# EAGLE design Pulsar Buddy SM (EAGLE 9.6.1)

## Sheet 1 of 2
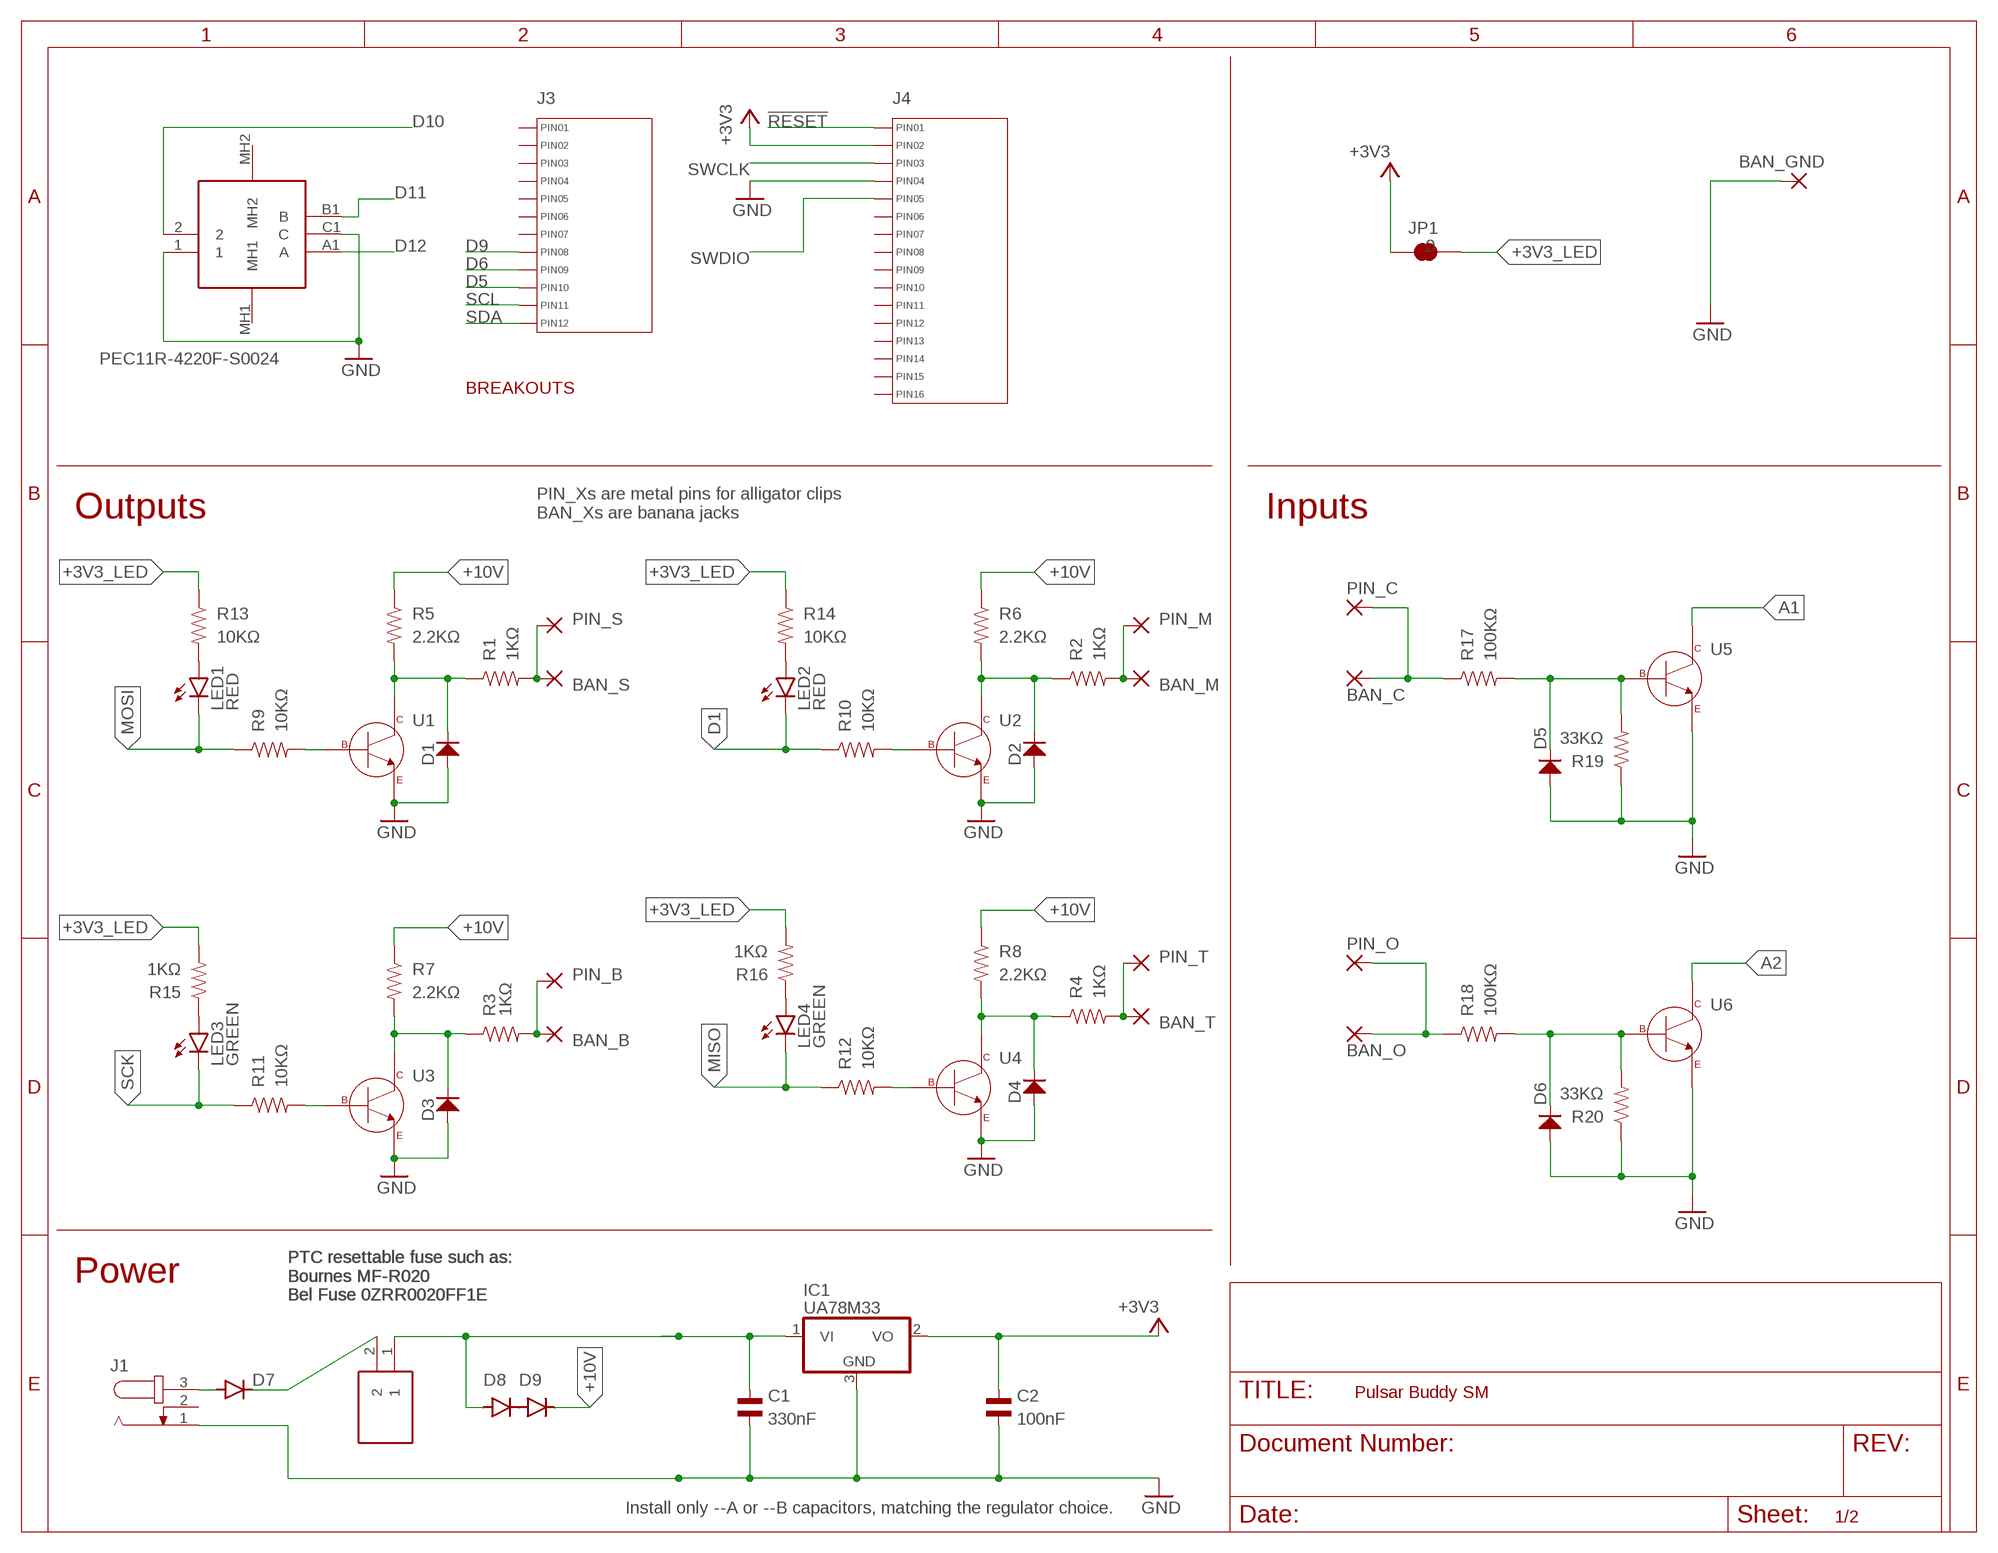
[diagram p0: schematic, sheet 1]

### Parts
BAN_B  WIREPADBANANA  [BANANA]
BAN_C  WIREPADBANANA  [BANANA]
BAN_GND  WIREPADBANANA-GND  [BANANA-GND]
BAN_M  WIREPADBANANA  [BANANA]
BAN_O  WIREPADBANANA  [BANANA]
BAN_S  WIREPADBANANA  [BANANA]
BAN_T  WIREPADBANANA  [BANANA]
C1  330nF  CAPACITOR_NP_0603  [C0603]
C2  100nF  CAPACITOR_NP_0603  [C0603]
D1  MF-DIO-SOD123-BAT42  DIODES_BAT42_SOD-123  [SOD-123]
D2  MF-DIO-SOD123-BAT42  DIODES_BAT42_SOD-123  [SOD-123]
D3  MF-DIO-SOD123-BAT42  DIODES_BAT42_SOD-123  [SOD-123]
D4  MF-DIO-SOD123-BAT42  DIODES_BAT42_SOD-123  [SOD-123]
D5  MF-DIO-SOD123-BAT42  DIODES_BAT42_SOD-123  [SOD-123]
D6  MF-DIO-SOD123-BAT42  DIODES_BAT42_SOD-123  [SOD-123]
D7  CGRM4004-G  [SOD-123_MINI-SMA]
D8  CGRM4004-G  [SOD-123_MINI-SMA]
D9  CGRM4004-G  [SOD-123_MINI-SMA]
F1  0ZCJ0020FF2E  [FUSC3216X75N]
IC1  UA78M33  7805DT  [TO252]
J1  JACK-PLUG0  [SPC4077]
J3  MF-CON-2.54mm-01x12  CON_01X12_PTH_2.54MM  [PTH_2.54MM_01X12]
J4  MF-CON-2.54mm-01x16  CON_01X16_PTH_2.54MM  [PTH_2.54MM_01X16]
JP1  JUMPER-SMT_2_NC_TRACE_SILK  [SMT-JUMPER_2_NC_TRACE_SILK]
LED1  RED  LED5MM  [LED5MM]
LED2  RED  LED5MM  [LED5MM]
LED3  GREEN  LED5MM  [LED5MM]
LED4  GREEN  LED5MM  [LED5MM]
PIN_B  WIREPAD  [M3]
PIN_C  WIREPAD  [M3]
PIN_M  WIREPAD  [M3]
PIN_O  WIREPAD  [M3]
PIN_S  WIREPAD  [M3]
PIN_T  WIREPAD  [M3]
R1  1KΩ  RESISTOR_0603  [R0603]
R2  1KΩ  RESISTOR_0603  [R0603]
R3  1KΩ  RESISTOR_0603  [R0603]
R4  1KΩ  RESISTOR_0603  [R0603]
R5  2.2KΩ  RESISTOR_0603  [R0603]
R6  2.2KΩ  RESISTOR_0603  [R0603]
R7  2.2KΩ  RESISTOR_0603  [R0603]
R8  2.2KΩ  RESISTOR_0603  [R0603]
R9  10KΩ  RESISTOR_0603  [R0603]
R10  10KΩ  RESISTOR_0603  [R0603]
R11  10KΩ  RESISTOR_0603  [R0603]
R12  10KΩ  RESISTOR_0603  [R0603]
R13  10KΩ  RESISTOR_0603  [R0603]
R14  10KΩ  RESISTOR_0603  [R0603]
R15  1KΩ  RESISTOR_0603  [R0603]
R16  1KΩ  RESISTOR_0603  [R0603]
R17  100KΩ  RESISTOR_0603  [R0603]
R18  100KΩ  RESISTOR_0603  [R0603]
R19  33KΩ  RESISTOR_0603  [R0603]
R20  33KΩ  RESISTOR_0603  [R0603]
SW1  PEC11R-4220F-S0024  [PEC11R4220FS0024]
U1  MF-DSC-SOT233-MMBT3904  NPN_BJTMMBT3904_SOT-23-3  [SOT-23-3]
U2  MF-DSC-SOT233-MMBT3904  NPN_BJTMMBT3904_SOT-23-3  [SOT-23-3]
U3  MF-DSC-SOT233-MMBT3904  NPN_BJTMMBT3904_SOT-23-3  [SOT-23-3]
U4  MF-DSC-SOT233-MMBT3904  NPN_BJTMMBT3904_SOT-23-3  [SOT-23-3]
U5  MF-DSC-SOT233-MMBT3904  NPN_BJTMMBT3904_SOT-23-3  [SOT-23-3]
U6  MF-DSC-SOT233-MMBT3904  NPN_BJTMMBT3904_SOT-23-3  [SOT-23-3]

### Nets
!RESET: J4.P$1(PIN1) ; also sheet 2
+3V3: C2.P$1 IC1.2(VO) J4.P$2(PIN2) JP1.1 ; also sheet 2
+3V3_LED: JP1.2 R13.P$1 R14.P$1 R15.P$2 R16.P$2
+10V: D9.C R5.P$1 R6.P$1 R7.P$1 R8.P$1
+12V: C1.P$1 D8.A F1.1 IC1.1(VI)
A1: U5.P$3(COLLECTOR) ; also sheet 2
A2: U6.P$3(COLLECTOR) ; also sheet 2
D1: LED2.K(C) R10.P$1 ; also sheet 2
D5: J3.P$10(PIN10) ; also sheet 2
D6: J3.P$9(PIN9) ; also sheet 2
D9: J3.P$8(PIN8) ; also sheet 2
D10: SW1.2 ; also sheet 2
D11: SW1.B1(B) ; also sheet 2
D12: SW1.A1(A) ; also sheet 2
GND: BAN_GND.C(P) C1.P$2 C2.P$2 D1.ANODE D2.ANODE D3.ANODE D4.ANODE D5.ANODE D6.ANODE IC1.3(GND) J1.1 J4.P$4(PIN4) R19.P$1 R20.P$1 SW1.1 SW1.C1(C) U1.P$2(EMITTER) U2.P$2(EMITTER) U3.P$2(EMITTER) U4.P$2(EMITTER) U5.P$2(EMITTER) U6.P$2(EMITTER) ; also sheet 2
MISO: LED4.K(C) R12.P$1 ; also sheet 2
MOSI: LED1.K(C) R9.P$1 ; also sheet 2
N$1: R10.P$2 U2.P$1(BASE)
N$4: D7.C F1.2
N$5: D7.A J1.3
N$6: LED1.A R13.P$2
N$7: LED2.A R14.P$2
N$8: R9.P$2 U1.P$1(BASE)
N$9: D1.CATHODE R1.P$1 R5.P$2 U1.P$3(COLLECTOR)
N$11: D2.CATHODE R2.P$1 R6.P$2 U2.P$3(COLLECTOR)
N$12: LED3.A R15.P$1
N$13: R11.P$2 U3.P$1(BASE)
N$14: D3.CATHODE R3.P$1 R7.P$2 U3.P$3(COLLECTOR)
N$15: LED4.A R16.P$1
N$16: R12.P$2 U4.P$1(BASE)
N$17: D4.CATHODE R4.P$1 R8.P$2 U4.P$3(COLLECTOR)
N$18: D5.CATHODE R17.P$2 R19.P$2 U5.P$1(BASE)
N$19: BAN_O.C(P) PIN_O.1(P) R18.P$1
N$20: BAN_C.C(P) PIN_C.1(P) R17.P$1
N$21: D6.CATHODE R18.P$2 R20.P$2 U6.P$1(BASE)
N$36: D8.C D9.A
N$37: BAN_S.C(P) PIN_S.1(P) R1.P$2
N$38: BAN_M.C(P) PIN_M.1(P) R2.P$2
N$39: BAN_T.C(P) PIN_T.1(P) R4.P$2
N$40: BAN_B.C(P) PIN_B.1(P) R3.P$2
SCK: LED3.K(C) R11.P$1 ; also sheet 2
SCL: J3.P$11(PIN11) ; also sheet 2
SDA: J3.P$12(PIN12) ; also sheet 2
SWCLK: J4.P$3(PIN3) ; also sheet 2
SWDIO: J4.P$5(PIN5) ; also sheet 2
Unconnected: J1.2 J3.P$1(PIN1) J3.P$2(PIN2) J3.P$3(PIN3) J3.P$4(PIN4) J3.P$5(PIN5) J3.P$6(PIN6) J3.P$7(PIN7) J4.P$6(PIN6) J4.P$7(PIN7) J4.P$8(PIN8) J4.P$9(PIN9) J4.P$10(PIN10) J4.P$11(PIN11) J4.P$12(PIN12) J4.P$13(PIN13) J4.P$14(PIN14) J4.P$15(PIN15) J4.P$16(PIN16) SW1.MH1 SW1.MH2

### Notes on the sheet
- BREAKOUTS
- Outputs
- PIN_Xs are metal pins for alligator clips
  BAN_Xs are banana jacks
- Inputs
- Power
- PTC resettable fuse such as:
  Bournes MF-R020
  Bel Fuse 0ZRR0020FF1E
- PTC resettable fuse such as:
  Bournes MF-R020
  Bel Fuse 0ZRR0020FF1E
- PTC resettable fuse such as:
  Bournes MF-R020
  Bel Fuse 0ZRR0020FF1E
- Install only --A or --B capacitors, matching the regulator choice.

## Sheet 2 of 2
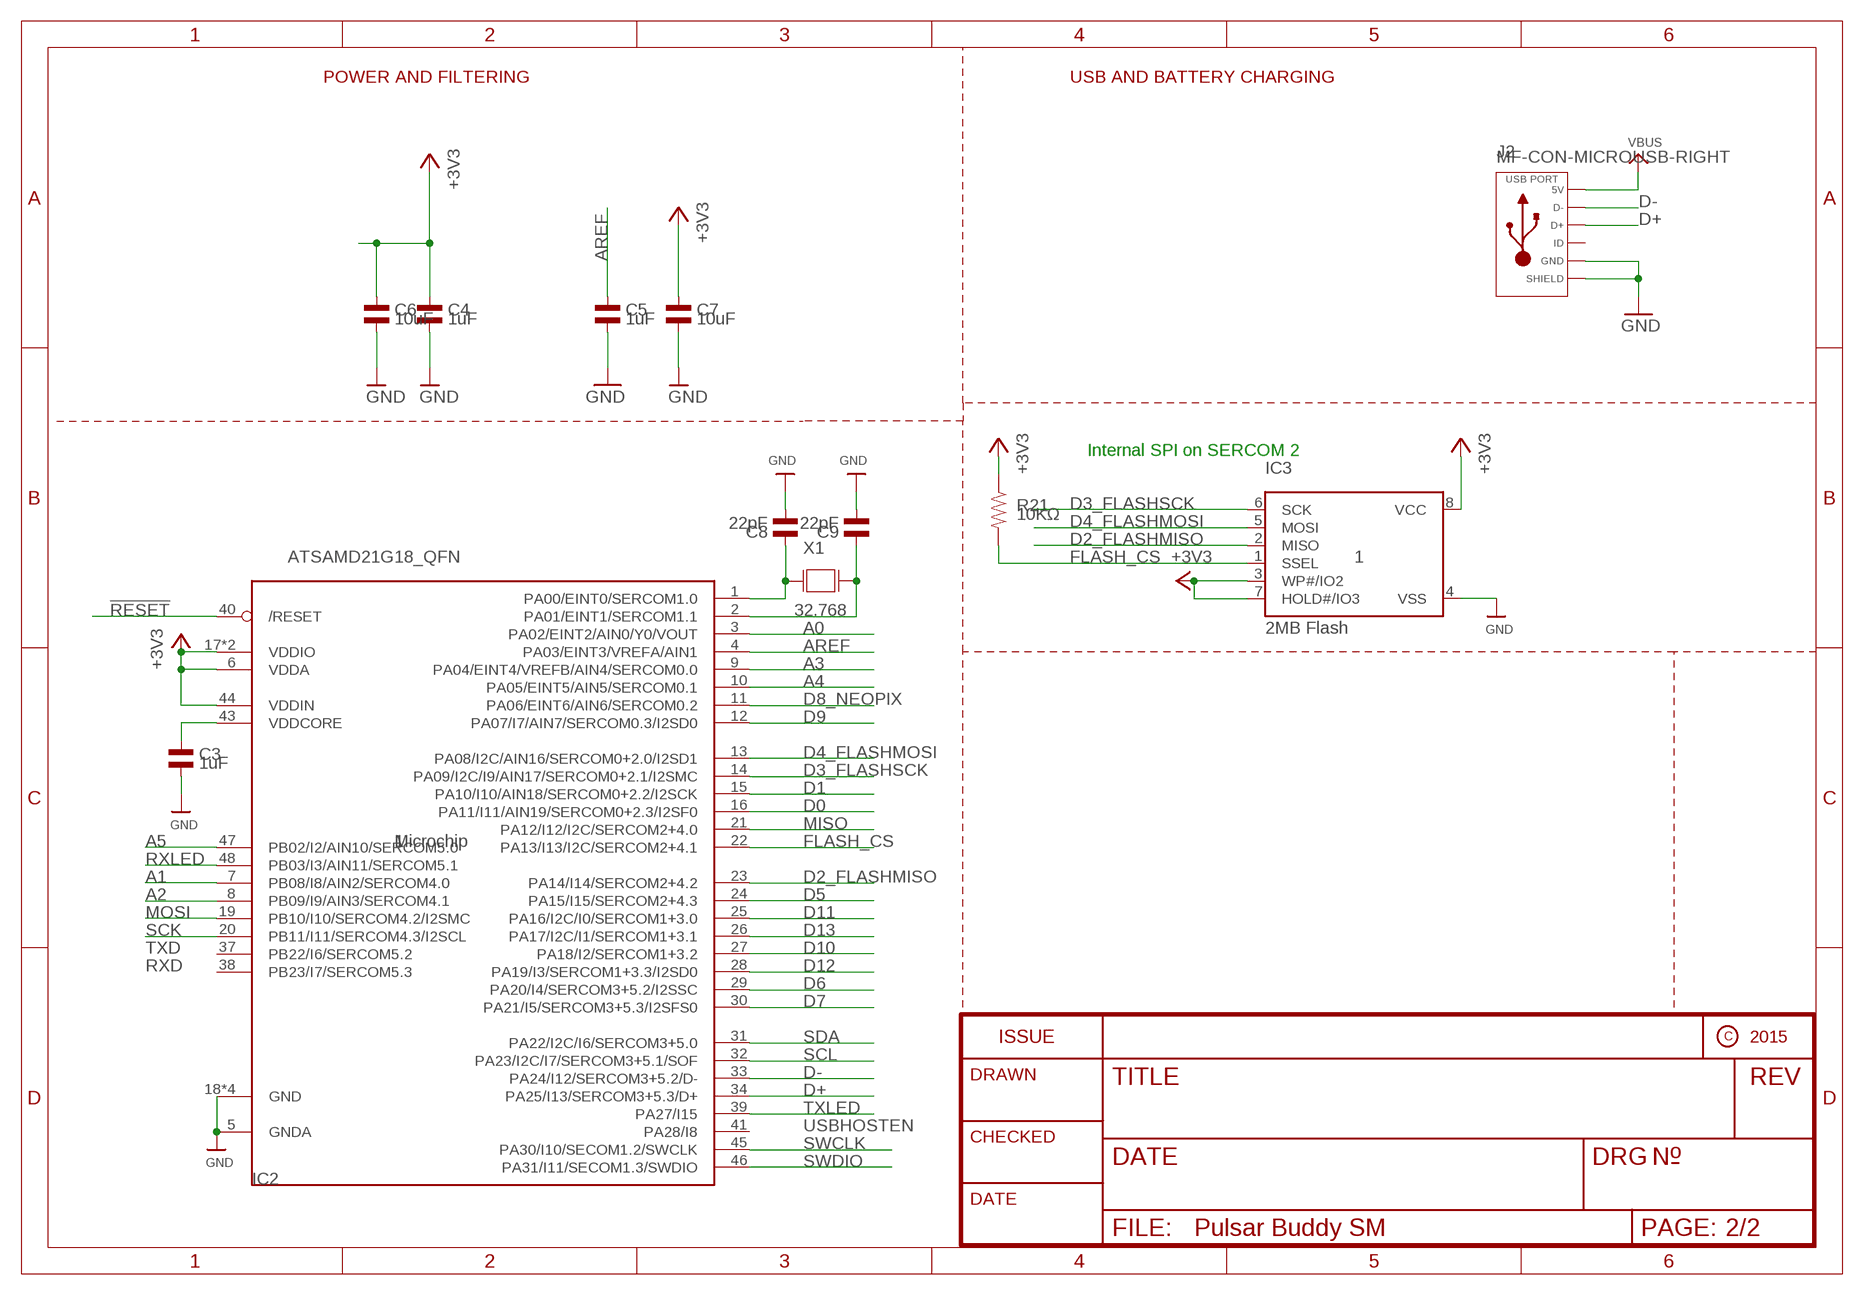
[diagram p1: schematic, sheet 2]

### Parts
C3  1uF  CAPACITOR_NP_0603  [C0603]
C4  1uF  CAPACITOR_NP_0603  [C0603]
C5  1uF  CAPACITOR_NP_0603  [C0603]
C6  10uF  CAPACITOR_NP_0603  [C0603]
C7  10uF  CAPACITOR_NP_0603  [C0603]
C8  22pF  CAPACITOR_NP_0603  [C0603]
C9  22pF  CAPACITOR_NP_0603  [C0603]
IC2  ATSAMD21G18_QFN  ATSAMD21G_QFN  [TQFN48_7MM]
IC3  2MB Flash  SPIFLASH_SOIC8208MIL  [SOIC8_208MIL]
J2  MF-CON-MICROUSB-RIGHT  USB_MICRO_RIGHT  [MICROUSB-RIGHT]
R21  10KΩ  RESISTOR_0603  [R0603]
U$34  FIDUCIAL_100MIL  [FIDUCIAL_100MIL]
U$35  FIDUCIAL_100MIL  [FIDUCIAL_100MIL]
X1  32.768  CYRSTAL_ECX-31B  [ECX-31B_SERIES]

### Nets
!RESET: IC2.40(/RESET) ; also sheet 1
+3V3: C4.P$1 C6.P$1 C7.P$1 IC2.6(VDDA) IC2.17(VDDIO) IC2.36(VDDIO) IC2.44(VDDIN) IC3.3(WP#/IO2) IC3.7(HOLD#/IO3) IC3.8(VCC) R21.P$1 ; also sheet 1
A0: IC2.3(PA02/EINT2/AIN0/Y0/VOUT)
A1: IC2.7(PB08/I8/AIN2/SERCOM4.0) ; also sheet 1
A2: IC2.8(PB09/I9/AIN3/SERCOM4.1) ; also sheet 1
A3: IC2.9(PA04/EINT4/VREFB/AIN4/SERCOM0.0)
A4: IC2.10(PA05/EINT5/AIN5/SERCOM0.1)
A5: IC2.47(PB02/I2/AIN10/SERCOM5.0)
AREF: C5.P$1 IC2.4(PA03/EINT3/VREFA/AIN1)
D0: IC2.16(PA11/I11/AIN19/SERCOM0+2.3/I2SF0)
D1: IC2.15(PA10/I10/AIN18/SERCOM0+2.2/I2SCK) ; also sheet 1
D2_FLASHMISO: IC2.23(PA14/I14/SERCOM2+4.2) IC3.2(MISO)
D3_FLASHSCK: IC2.14(PA09/I2C/I9/AIN17/SERCOM0+2.1/I2SMC) IC3.6(SCK)
D4_FLASHMOSI: IC2.13(PA08/I2C/AIN16/SERCOM0+2.0/I2SD1) IC3.5(MOSI)
D5: IC2.24(PA15/I15/SERCOM2+4.3) ; also sheet 1
D6: IC2.29(PA20/I4/SERCOM3+5.2/I2SSC) ; also sheet 1
D7: IC2.30(PA21/I5/SERCOM3+5.3/I2SFS0)
D8_NEOPIX: IC2.11(PA06/EINT6/AIN6/SERCOM0.2)
D9: IC2.12(PA07/I7/AIN7/SERCOM0.3/I2SD0) ; also sheet 1
D10: IC2.27(PA18/I2/SERCOM1+3.2) ; also sheet 1
D11: IC2.25(PA16/I2C/I0/SERCOM1+3.0) ; also sheet 1
D12: IC2.28(PA19/I3/SERCOM1+3.3/I2SD0) ; also sheet 1
D13: IC2.26(PA17/I2C/I1/SERCOM1+3.1)
D+: IC2.34(PA25/I13/SERCOM3+5.3/D+) J2.3(D+)
D-: IC2.33(PA24/I12/SERCOM3+5.2/D-) J2.2(D-)
FLASH_CS: IC2.22(PA13/I13/I2C/SERCOM2+4.1) IC3.1(SSEL) R21.P$2
GND: C3.P$2 C4.P$2 C5.P$2 C6.P$2 C7.P$2 C8.P$2 C9.P$2 IC2.5(GNDA) IC2.18(GND) IC2.35(GND) IC2.42(GND) IC2.THERMAL(GND) IC3.4(VSS) J2.5(GND) J2.S1(SLD) J2.S2(SLD) J2.S3(SLD) J2.S4(SLD) J2.S5(SLD) J2.S6(SLD) ; also sheet 1
MISO: IC2.21(PA12/I12/I2C/SERCOM2+4.0) ; also sheet 1
MOSI: IC2.19(PB10/I10/SERCOM4.2/I2SMC) ; also sheet 1
N$45: C8.P$1 IC2.1(PA00/EINT0/SERCOM1.0) X1.P$1(X0)
N$46: C9.P$1 IC2.2(PA01/EINT1/SERCOM1.1) X1.P$2(X1)
RXLED: IC2.48(PB03/I3/AIN11/SERCOM5.1)
SCK: IC2.20(PB11/I11/SERCOM4.3/I2SCL) ; also sheet 1
SCL: IC2.32(PA23/I2C/I7/SERCOM3+5.1/SOF) ; also sheet 1
SDA: IC2.31(PA22/I2C/I6/SERCOM3+5.0) ; also sheet 1
SWCLK: IC2.45(PA30/I10/SECOM1.2/SWCLK) ; also sheet 1
SWDIO: IC2.46(PA31/I11/SECOM1.3/SWDIO) ; also sheet 1
TXLED: IC2.39(PA27/I15)
VBUS: J2.1(5V)
VDDCORE1: C3.P$1 IC2.43(VDDCORE)
Unconnected: IC2.37(PB22/I6/SERCOM5.2) IC2.38(PB23/I7/SERCOM5.3) IC2.41(PA28/I8) J2.4(ID)

### Notes on the sheet
- POWER AND FILTERING | USB AND BATTERY CHARGING
- Internal SPI on SERCOM 2
- TXD
- RXD
- USBHOSTEN

## Library data of the parts
BAN_B BAN_C BAN_GND BAN_M BAN_O BAN_S BAN_T PIN_B PIN_C PIN_M PIN_O PIN_S PIN_T = bits:WIREPAD: Wire PAD connect wire on PCB; POPULATE: 0
C1 = MF_Passives:CAPACITOR_NP: Library: MF_Passives Description: Device for Non-Polarized Capacitors. Manufacture part number (MPN) can be added via Attributes. Check https://factory.macrofab.com/parts for the house parts list.; MFR: Yageo; MPN: CC0603ZRY5V7BB334; POPULATE: 1
C2 = MF_Passives:CAPACITOR_NP: Library: MF_Passives Description: Device for Non-Polarized Capacitors. Manufacture part number (MPN) can be added via Attributes. Check https://factory.macrofab.com/parts for the house parts list.; MFR: Yageo; MPN: CC0603KRX7R9BB104; POPULATE: 1
C3-C5 = MF_Passives:CAPACITOR_NP: Library: MF_Passives Description: Device for Non-Polarized Capacitors. Manufacture part number (MPN) can be added via Attributes. Check https://factory.macrofab.com/parts for the house parts list.; HOUSEPART: YES; MPN: MF-CAP-0603-1uF; POPULATE: 1
C6 C7 = MF_Passives:CAPACITOR_NP: Library: MF_Passives Description: Device for Non-Polarized Capacitors. Manufacture part number (MPN) can be added via Attributes. Check https://factory.macrofab.com/parts for the house parts list.; MFR: AVX; MPN: 0603ZD106KAT2A; POPULATE: 1
C8 C9 = MF_Passives:CAPACITOR_NP: Library: MF_Passives Description: Device for Non-Polarized Capacitors. Manufacture part number (MPN) can be added via Attributes. Check https://factory.macrofab.com/parts for the house parts list.; HOUSEPART: YES; MPN: MF-CAP-0603-22pF; POPULATE: 1
D1-D6 = MF_Discrete_Semiconductor:DIODES: Library: MF_Discrete_Semiconductor Description: Device for Single Packaged Diodes.; HOUSEPART: YES; MPN: MF-DIO-SOD123-BAT42; POPULATE: 1; URL: https://factory.macrofab.com/part/MF-DIO-SOD123-BAT42
D7-D9 = diode:CGRM400*-G: Molded plasitc,JEDEC SOD-123/Mini SMA Source: Comchip CGRM4001-G.pdf; MFR: Comchip; MPN: CGRM4004-G; POPULATE: 1
F1 = pb extras:0ZCJ0020FF2E: BEL FUSE - CIRCUIT PROTECTION - 0ZCJ0020FF2E - FUSE, RESETTABLE PTC, 30VDC, 0.2A, SMD Source: Datasheet <https://componentsearchengine.com/Datasheets/2/0ZCJ0020FF2E.pdf>; DESCRIPTION: BEL FUSE - CIRCUIT PROTECTION - 0ZCJ0020FF2E - FUSE, RESETTABLE PTC, 30VDC, 0.2A, SMD; HEIGHT: 0.75mm; MANUFACTURER_NAME: BEL CIRCUIT PROTECTION; MANUFACTURER_PART_NUMBER: 0ZCJ0020FF2E; MFR: Bel Fuse; MPN: 0ZCJ0020FF2E
IC1 = adafruit:78*: Positive VOLTAGE REGULATOR Added bigger pads to the TO-92 package; MFR: Texas Instruments; MPN: UA78M33CKVURG3; POPULATE: 1
IC2 = microbuilder:ATSAMD21G; MFR: Microchip; MPN: SAMD21G18A-MU; POPULATE: 1
IC3 = microbuilder:SPIFLASH_SOIC8: SOIC8 SPI Flash Be careful with the size since SOIC8 flash comes in several 'widths' SOIC8 150 mil M25P16 - 16Mbit (2Mbit x 8) Serial Flash (75MHz SPI Bus), Supply: 2.7-3.6V Digikey: SOIC8 - M25P16-VMN6P-ND SOIC8 208 mil W25Q16BVSSIG - 16Mbit (2Mbit x 8) Serial Flash (104MHz SPI Bus), Supply: 2.7-3.6V Digikey: SOIC8 - W25Q16BVSSIG-ND; MFR: Cypress; MPN: S25FL064LABMFI010; POPULATE: 1
J1 = con-jack:JACK-PLUG: DC POWER JACK Power Jack, DC, Right Angle, Through Hole, Rated 5A at 16VDC, PC Terminals Distributor: Farnell (www.Farnell.de) Drawing: 84N1161.pdf / 84N1162.pdf Manufacturer: SPC Technology (www.spctechnology.com) Type: SPC4077 / SPC 4078; OC_FARNELL: unknown; OC_NEWARK: unknown; POPULATE: 0
J2 = MF_Connectors:USB: Library: MF_Connectors Description: 5 Pin USB Connectors. SLD is the shield connection. Usually tied to ground through a small ferrite bead.; HOUSEPART: YES; MPN: MF-CON-MICROUSB-RIGHT; POPULATE: 1; URL: https://factory.macrofab.com/part/MF-CON-MICROUSB-RIGHT
J3 = MF_Connectors:CON_01X12: Library: MF_Connectors Description: Header Connector with 12 Positions and 01 Rows. Use the LABEL Attribute to label the pin on the schematic and PCB. You can remove the attributes on the PCB by using the SMASH function on the part and then deleting the text.; HOUSEPART: YES; MPN: MF-CON-2.54mm-01x12; POPULATE: 1; URL: https://factory.macrofab.com/part/MF-CON-2.54mm-01x12
J4 = MF_Connectors:CON_01X16: Library: MF_Connectors Description: Header Connector with 16 Positions and 01 Rows. Use the LABEL Attribute to label the pin on the schematic and PCB. You can remove the attributes on the PCB by using the SMASH function on the part and then deleting the text.; HOUSEPART: YES; MPN: MF-CON-2.54mm-01x16; POPULATE: 1; URL: https://factory.macrofab.com/part/MF-CON-2.54mm-01x17
JP1 = SparkFun-Jumpers:JUMPER-SMT_2_NC_TRACE: Normally closed trace jumper This jumper has a trace between two pads so it's normally closed (NC). Use a razor knife to open the connection. For best results follow the IPC guidelines for cutting traces: Cutout at least 0.063 mm (0.005 in). Remove all loose material to clean up the cut area. Seal the cut with an approved epoxy. Reapply solder to reclose the connection.; POPULATE: 0
LED1-LED4 = led:LED: LED OSRAM: - CHIPLED LG R971, LG N971, LY N971, LG Q971, LY Q971, LO R971, LY R971 LH N974, LH R974 LS Q976, LO Q976, LY Q976 LO Q996 - Hyper CHIPLED LW Q18S LB Q993, LB Q99A, LB R99A - SideLED LS A670, LO A670, LY A670, LG A670, LP A670 LB A673, LV A673, LT A673, LW A673 LH A674 LY A675 LS A676, LA A676, LO A676, LY A676, LW A676 LS A679, LY A679, LG A679 - Hyper Micro SIDELED® LS Y876, LA Y876, LO Y876, LY Y876 LT Y87S - SmartLED LW L88C, LW L88S LB L89C, LB L89S, LG L890 LS L89K, LO L89K, LY L89K LS L896, LA L896, LO L896, LY L896 - TOPLED LS T670, LO T670, LY T670, LG T670, LP T670 LSG T670, LSP T670, LSY T670, LOP T670, LYG T670 LG T671, LOG T671, LSG T671 LB T673, LV T673, LT T673, LW T673 LH T674 LS T676, LA T676, LO T676, LY T676, LB T676, LH T676, LSB T676, LW T676 LB T67C, LV T67C, LT T67C, LS T67K, LO T67K, LY T67K, LW E67C LS E67B, LA E67B, LO E67B, LY E67B, LB E67C, LV E67C, LT E67C LW T67C LS T679, LY T679, LG T679 LS T770, LO T770, LY T770, LG T770, LP T770 LB T773, LV T773, LT T773, LW T773 LH T774 LS E675, LA E675, LY E675, LS T675 LS T776, LA T776, LO T776, LY T776, LB T776 LHGB T686 LT T68C, LB T68C - Hyper Mini TOPLED® LB M676 - Mini TOPLED Santana® LG M470 LS M47K, LO M47K, LY M47K Source: http://www.osram.convergy.de LUXEON: - LUMILED® LXK2-PW12-R00, LXK2-PW12-S00, LXK2-PW14-U00, LXK2-PW14-V00 LXK2-PM12-R00, LXK2-PM12-S00, LXK2-PM14-U00 LXK2-PE12-Q00, LXK2-PE12-R00, LXK2-PE12-S00, LXK2-PE14-T00, LXK2-PE14-U00 LXK2-PB12-K00, LXK2-PB12-L00, LXK2-PB12-M00, LXK2-PB14-N00, LXK2-PB14-P00, LXK2-PB14-Q00 LXK2-PR12-L00, LXK2-PR12-M00, LXK2-PR14-Q00, LXK2-PR14-R00 LXK2-PD12-Q00, LXK2-PD12-R00, LXK2-PD12-S00 LXK2-PH12-R00, LXK2-PH12-S00 LXK2-PL12-P00, LXK2-PL12-Q00, LXK2-PL12-R00 Source: www.luxeon.com KINGBRIGHT: KA-3528ASYC Source: www.kingbright.com; POPULATE: 0
R1-R4 R15 R16 = MF_Passives:RESISTOR: Library: MF_Passives Description: Device for Resistors. Manufacture part number (MPN), Voltage, Tolerance, and Wattage Rating can be added via Attributes. Check https://factory.macrofab.com/parts for the house parts list.; MPN: MF-RES-0603-1K; POPULATE: 1
R5-R8 = MF_Passives:RESISTOR: Library: MF_Passives Description: Device for Resistors. Manufacture part number (MPN), Voltage, Tolerance, and Wattage Rating can be added via Attributes. Check https://factory.macrofab.com/parts for the house parts list.; MFR: Yageo; MPN: RC0603JR-072K2L; POPULATE: 1
R9-R14 R21 = MF_Passives:RESISTOR: Library: MF_Passives Description: Device for Resistors. Manufacture part number (MPN), Voltage, Tolerance, and Wattage Rating can be added via Attributes. Check https://factory.macrofab.com/parts for the house parts list.; MPN: MF-RES-0603-10K; POPULATE: 1
R17 R18 = MF_Passives:RESISTOR: Library: MF_Passives Description: Device for Resistors. Manufacture part number (MPN), Voltage, Tolerance, and Wattage Rating can be added via Attributes. Check https://factory.macrofab.com/parts for the house parts list.; MPN: MF-RES-0603-100K; POPULATE: 1
R19 R20 = MF_Passives:RESISTOR: Library: MF_Passives Description: Device for Resistors. Manufacture part number (MPN), Voltage, Tolerance, and Wattage Rating can be added via Attributes. Check https://factory.macrofab.com/parts for the house parts list.; MFR: Yageo; MPN: RC0603FR-0733KL; POPULATE: 1
SW1 = SamacSys:PEC11R-4220F-S0024: Bourns 24 Pulse Incremental Mechanical Rotary Encoder with a 6 mm Flat Shaft (Not Indexed), Through Hole Source: Datasheet <https://www.bourns.com/docs/Product-Datasheets/PEC11R.pdf>; ALLIED_NUMBER: 70276555; ALLIED_PRICE-STOCK: https://www.alliedelec.com/bourns-pec11r-4220f-s0024/70276555/; DESCRIPTION: Bourns 24 Pulse Incremental Mechanical Rotary Encoder with a 6 mm Flat Shaft (Not Indexed), Through Hole; HEIGHT: 27.5mm; MANUFACTURER_NAME: Bourns; MANUFACTURER_PART_NUMBER: PEC11R-4220F-S0024; MFR: Bourns; MOUSER_PART_NUMBER: 652-PEC11R-4220F-S24; MOUSER_PRICE-STOCK: https://www.mouser.com/Search/Refine.aspx?Keyword=652-PEC11R-4220F-S24; MPN: PEC11R-4220F-S0024; RS_PART_NUMBER: 7377767P; RS_PRICE-STOCK: http://uk.rs-online.com/web/p/products/7377767P
U1-U6 = MF_Discrete_Semiconductor:NPN_BJT: Library: MF_Discrete_Semiconductor Description: Device for Single NPN BJT Transistors. Manufacture part number (MFG#) can be added via Attributes.; HOUSEPART: YES; MPN: MF-DSC-SOT233-MMBT3904; POPULATE: 1; URL: https://factory.macrofab.com/part/MF-DSC-SOT233-MMBT3904
U$34 U$35 = MF_Aesthetics:FIDUCIAL: Library: MF_Aesthetics Description: Fiducial marking for PCB alignment inside PNP and other machines.; HOUSEPART: NO; POPULATE: 0
X1 = MF_Frequency_Control:CYRSTAL: Library: MF_Frequency_Control Description: Device for two functional pin Cyrstal Oscillators.; HOUSEPART: NO; MFR: ECS International; MPN: ECS-.327-7-12-C-TR; POPULATE: 1; URL: https://www.ecsxtal.com/store/pdf/ecx-31b.pdf

## Board
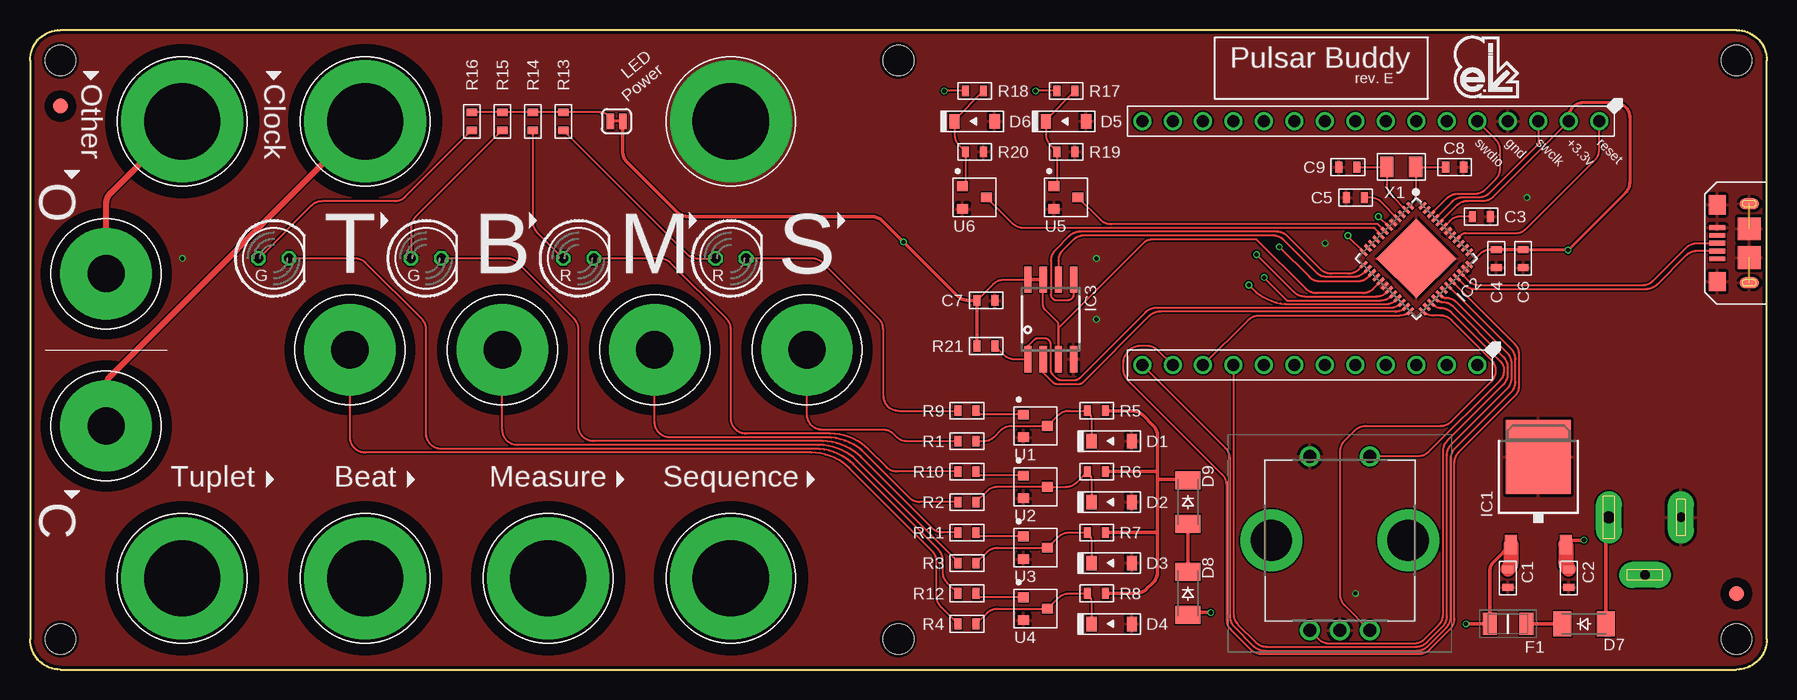
[diagram p2: board, top side]
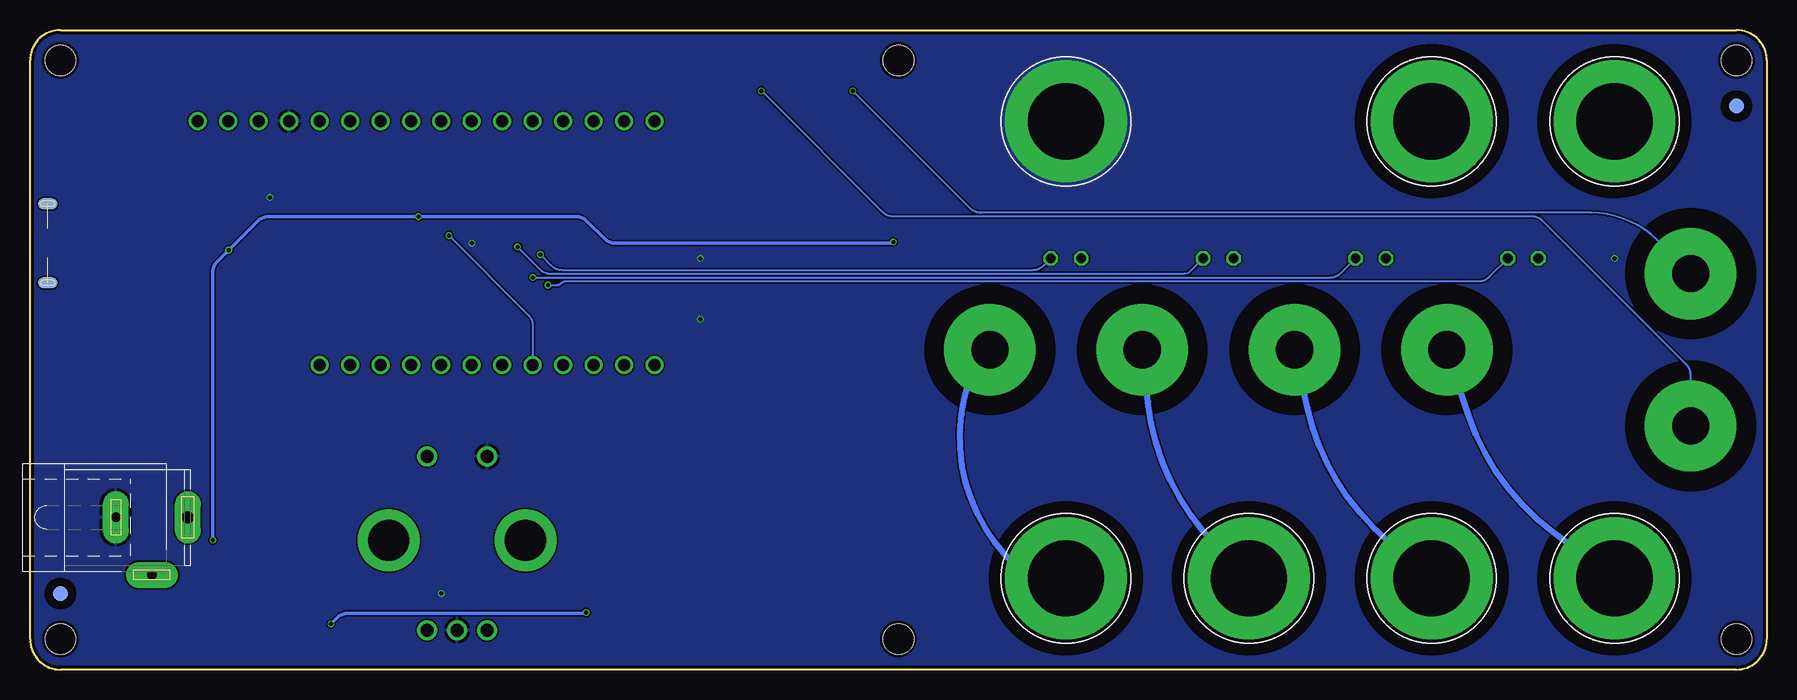
[diagram p3: board, bottom side, seen from below]

Size 144.78 x 53.34 mm. Coordinates in mm from the lower left corner, seen from the top.
Outline: 2.54,0 142.24,0 arc90 144.78,2.54 144.78,50.8 arc90 142.24,53.34 2.54,53.34 arc90 0,50.8 0,2.54 arc90 2.54,0
Copper layers (1*16): Top 0.035mm / dielectric 1.5mm / Bottom 0.035mm
Design rules "MF_Standard_2_Layer": minimum track width 5mil, minimum drill 10mil, track to track 5mil, track to pad 5mil, pad to pad 5mil, via to via 5mil, smd to smd 0mil, copper to edge 10mil, drill to drill 10mil, minimum pad ring 4mil, minimum via ring 4mil, stop-mask expansion 2mil, vias tented up to drill 25mil, thermal gap 10mil
Holes 2.54 mm at 2.54,50.8 142.24,50.8 142.24,2.54 2.54,2.54 72.39,2.54 72.39,50.8

### Footprints (pad centres in the part's own frame; a part is rotated, then mirrored left to right if it is on the bottom)
BANANA = drill 6.35 pad 10.16: C 0,0
BANANA-GND = drill 6.35 pad 10.16: C 0,0
C0603 = smd 0.6 x 0.9: P$1 -0.75,0; P$2 0.75,0
SOD-123 = smd 0.85 x 1.2: ANODE 1.675,0; CATHODE -1.675,0
SOD-123_MINI-SMA = smd 1.5 x 2.1: A 1.8,0; C -1.8,0
FUSC3216X75N = smd 1.17 x 1.82: 1 -1.52,0; 2 1.52,0
TO252 = smd 1 x 1.6: 1 -2.28,-4.8; 2 2.28,-4.8 | smd 5.4 x 6.2: 3 0,2.5
TQFN48_7MM = smd 0.25 x 0.75: 1 -2.75,-3.475; 2 -2.25,-3.475; 3 -1.75,-3.475; 4 -1.25,-3.475; 5 -0.75,-3.475; 6 -0.25,-3.475; 7 0.25,-3.475; 8 0.75,-3.475; 9 1.25,-3.475; 10 1.75,-3.475; 11 2.25,-3.475; 12 2.75,-3.475; 25 2.75,3.475; 26 2.25,3.475; 27 1.75,3.475; 28 1.25,3.475; 29 0.75,3.475; 30 0.25,3.475; 31 -0.25,3.475; 32 -0.75,3.475; 33 -1.25,3.475; 34 -1.75,3.475; 35 -2.25,3.475; 36 -2.75,3.475 | smd 0.75 x 0.25: 13 3.475,-2.75; 14 3.475,-2.25; 15 3.475,-1.75; 16 3.475,-1.25; 17 3.475,-0.75; 18 3.475,-0.25; 19 3.475,0.25; 20 3.475,0.75; 21 3.475,1.25; 22 3.475,1.75; 23 3.475,2.25; 24 3.475,2.75; 37 -3.475,2.75; 38 -3.475,2.25; 39 -3.475,1.75; 40 -3.475,1.25; 41 -3.475,0.75; 42 -3.475,0.25; 43 -3.475,-0.25; 44 -3.475,-0.75; 45 -3.475,-1.25; 46 -3.475,-1.75; 47 -3.475,-2.25; 48 -3.475,-2.75 | smd 4.7 x 4.7: THERMAL 0,0
SOIC8_208MIL = smd 0.6 x 2.2: 1 -1.905,-3.315; 2 -0.635,-3.315; 3 0.635,-3.315; 4 1.905,-3.315; 5 1.905,3.315; 6 0.635,3.315; 7 -0.635,3.315; 8 -1.905,3.315
SPC4077 = drill 0.8 pad 2.184 long: 1 -3,0; 2 0,-4.8 | drill 1 pad 2.184 long: 3 3,0
MICROUSB-RIGHT = smd 0.4 x 1.35: 1 -1.3,1.27; 2 -0.65,1.27; 3 0,1.27; 4 0.65,1.27; 5 1.3,1.27 | smd 0.9 x 1.6: S1 -3.3,-1.4; S2 3.3,-1.4 | smd 1.6 x 1.4: S3 -3.2,1.27; S4 3.2,1.27 | smd 1.9 x 1.9: S5 -1.2,-1.405; S6 1.2,-1.405 | smd 0.9 x 1.6 bottom: S7 -3.3,-1.4; S8 3.3,-1.4
PTH_2.54MM_01X12 = drill 1: P$1 -13.97,0; P$2 -11.43,0; P$3 -8.89,0; P$4 -6.35,0; P$5 -3.81,0; P$6 -1.27,0; P$7 1.27,0; P$8 3.81,0; P$9 6.35,0; P$10 8.89,0; P$11 11.43,0; P$12 13.97,0
PTH_2.54MM_01X16 = drill 1: P$1 -19.05,0; P$2 -16.51,0; P$3 -13.97,0; P$4 -11.43,0; P$5 -8.89,0; P$6 -6.35,0; P$7 -3.81,0; P$8 -1.27,0; P$9 1.27,0; P$10 3.81,0; P$11 6.35,0; P$12 8.89,0; P$13 11.43,0; P$14 13.97,0; P$15 16.51,0; P$16 19.05,0
SMT-JUMPER_2_NC_TRACE_SILK = smd 0.635 x 1.27: 1 -0.508,0; 2 0.508,0
LED5MM = drill 0.813 octagon: A -1.27,0; K 1.27,0
M3 = drill 3.1 pad 7.62: 1 0,0
R0603 = smd 0.6 x 0.9: P$1 -0.75,0; P$2 0.75,0
PEC11R4220FS0024 = drill 1.1 pad 1.65: 1 0,0; 2 5,0; A1 0,-14.5; B1 5,-14.5; C1 2.5,-14.5 | drill 3.441 pad 5.161: MH1 -3.2,-7; MH2 8.2,-7
SOT-23-3 = smd 0.9 x 0.8: P$1 -1,0.95; P$2 -1,-0.95; P$3 1,0
FIDUCIAL_100MIL = smd 1.27 x 1.27: P$1 0,0 | smd 1.27 x 1.27 bottom: P$2 0,0
ECX-31B_SERIES = smd 1.1 x 1.7: P$1 -1.2,0; P$2 1.2,0

### Placement (x,y rotation side)
BAN_B  27.94,7.62 0 top
BAN_C  27.94,45.72 0 top
BAN_GND  58.42,45.72 0 top
BAN_M  43.18,7.62 0 top
BAN_O  12.7,45.72 0 top
BAN_S  58.42,7.62 0 top
BAN_T  12.7,7.62 0 top
C1  123.19,7.62 270 top
C2  128.27,7.62 270 top
C3  120.97,37.78 0 top
C4  122.24,34.29 270 top
C5  110.49,39.37 180 top
C6  124.46,34.29 270 top
C7  79.69,30.8 0 top
C8  118.75,41.91 0 top
C9  109.86,41.91 180 top
D1  90.17,19.05 0 top
D2  90.17,13.97 0 top
D3  90.17,8.89 0 top
D4  90.17,3.81 0 top
D5  86.36,45.72 0 top
D6  78.74,45.72 0 top
D7  129.54,3.81 0 top
D8  96.52,6.35 270 top
D9  96.52,13.97 270 top
F1  123.19,3.81 0 top
IC1  125.73,15.24 0 top
IC2  115.57,34.29 225 top
IC3  85.09,29.21 0 top
J1  134.62,12.7 0 bottom
J2  141.91,35.56 90 top
J3  106.68,25.4 180 top
J4  111.76,45.72 180 top
JP1  48.9,45.72 180 top
LED1  58.42,34.29 0 top
LED2  45.72,34.29 0 top
LED3  33.02,34.29 0 top
LED4  20.32,34.29 0 top
PIN_B  39.37,26.67 0 top
PIN_C  6.35,20.32 0 top
PIN_M  52.07,26.67 0 top
PIN_O  6.35,33.02 0 top
PIN_S  64.77,26.67 0 top
PIN_T  26.67,26.67 0 top
R1  78.11,19.05 180 top
R2  78.11,13.97 180 top
R3  78.11,8.89 180 top
R4  78.11,3.81 180 top
R5  88.9,21.59 180 top
R6  88.9,16.51 180 top
R7  88.9,11.43 180 top
R8  88.9,6.35 180 top
R9  78.11,21.59 0 top
R10  78.11,16.51 0 top
R11  78.11,11.43 0 top
R12  78.11,6.35 0 top
R13  44.45,45.72 270 top
R14  41.91,45.72 270 top
R15  39.37,45.72 90 top
R16  36.83,45.72 90 top
R17  86.36,48.26 0 top
R18  78.74,48.26 0 top
R19  86.36,43.18 180 top
R20  78.74,43.18 180 top
R21  79.69,26.99 0 top
SW1  106.68,17.78 0 top
U1  83.82,20.32 0 top
U2  83.82,15.24 0 top
U3  83.82,10.16 0 top
U4  83.82,5.08 0 top
U5  86.36,39.37 0 top
U6  78.74,39.37 0 top
U$34  142.24,6.35 0 top
U$35  2.54,46.99 0 top
X1  114.3,41.91 180 top

### Tracks (layer width: path | path; a pad name or v marks a point on that pad's centre or on a via)
!RESET
  Top 0.152: J4.P$1 130.81,43.39 arc-45 130.44,42.49 124.7,36.76 arc-45 123.81,36.38 119.7,36.38 119.67,36.38 arc45 119.26,36.21 IC2.40
+3V3  (via drill 0.35)
  Top 0.152: IC2.36 120.86,34.67 arc-45 121.76,35.04 C4.P$1 | IC2.17 111.99,31.77 arc-45 111.09,31.39 107.24,31.39 arc-45 106.35,31.77 102.23,35.88 93.63,35.88 arc45 92.73,35.51 85.72,28.5 IC3.3 85.72,28.89 84.6,30.01 arc-45 84.45,30.37 IC3.7 | C7.P$1 80.3,32.15 arc-45 81.2,32.52 83.5,32.52 | J4.P$2 121.99,39.44 arc-45 121.09,39.07 119.81,39.07 arc45 118.92,38.7 IC2.44 | IC2.6 113.25,36.92 v112.39,37.78
  Top 0.254: J4.P$2 128.27,46.04 arc-90 129.54,47.31 132.08,47.31 arc-90 133.35,46.04 133.35,40.65 arc-45 132.98,39.75 v128.21,34.98 124.52,34.98 C6.P$1
  Top 0.305: C6.P$1 C4.P$1 | R21.P$1 C7.P$1 78.2,30.8 arc-45 77.3,31.17 v72.81,35.66 71.06,37.41 arc45 70.16,37.78 54.82,37.78 arc-45 53.92,38.15 49.77,42.3 arc-45 49.4,43.2 JP1.1 | IC3.8 83.5,32.52 IC3.7 | IC1.2 128.37,10.79 v129.54,10.79
  Top 1.27: IC1.2 128.01,9 arc45 C2.P$1
  Bottom 0.305: v129.54,10.79 129.54,33.13 arc45 129.17,34.03 v128.21,34.98 125.78,37.41 arc45 124.89,37.78 v112.39,37.78 99.27,37.78 arc45 98.37,37.41 96.89,35.93 arc-45 95.99,35.56 72.91,35.56 v72.81,35.66
+3V3_LED
  Top 0.152: R16.P$2 R15.P$2 R14.P$1 R13.P$1 47.49,46.47 arc-45 48.26,46.15 48.26,45.85 JP1.2
+10V
  Top 0.305: R5.P$1 91.87,21.59 arc-45 92.76,21.22 93.61,20.37 arc-45 93.98,19.48 93.98,16.51 | 93.98,16.51 93.98,15.88 | 93.98,15.88 93.98,11.43 | 93.98,11.43 93.98,8.15 arc-45 93.61,7.25 93.08,6.72 arc-45 92.18,6.35 R8.P$1 | R7.P$1 93.98,11.43 | R6.P$1 93.98,16.51 | 93.98,15.88 96.42,15.88 D9.C
+12V  (via drill 0.35)
  Top 0.305: IC1.1 122.04,9.03 arc45 121.67,8.13 F1.1 v119.7,3.81 | v98.42,4.76 96.73,4.76 D8.A
  Top 1.27: IC1.1 123.45,9 arc-45 C1.P$1
  Bottom 0.305: v119.7,3.81 119.18,4.33 arc45 118.28,4.7 98.49,4.7 v98.42,4.76
A1
  Top 0.152: IC2.7 112.36,37.15 90.11,37.15 arc-45 89.21,37.52 U5.P$3
A2
  Top 0.152: IC2.8 112.58,36.33 112.08,36.83 82.81,36.83 arc-45 81.91,37.2 U6.P$3
AREF
  Top 0.152: IC2.4 112.63,39 arc45 111.73,39.37 C5.P$1
D1  (via drill 0.35)
  Top 0.152: v104.14,35.24 106.63,32.76 arc45 107.52,32.38 110.66,32.38 arc45 111.56,32.76 IC2.15 | R10.P$1 72.28,16.51 arc-45 71.38,16.88 69.9,18.36 arc45 66.71,19.68 59.69,19.68 arc-90 58.42,20.95 58.42,28.37 arc45 58.05,29.26 53.39,33.92 arc45 52.5,34.29 LED2.K
  Bottom 0.152: v104.14,35.24 102.29,33.39 arc-45 101.39,33.02 48.7,33.02 48.52,33.03 48.16,33.12 LED2.K
D2_FLASHMISO
  Top 0.152: IC2.23 114.68,30.22 arc-45 113.78,29.84 94.19,29.84 arc45 93.29,29.47 87.78,23.96 arc-45 87.42,23.81 85.62,23.81 arc-45 85.26,23.96 84.45,24.77 IC3.2
D3_FLASHSCK
  Top 0.152: IC2.14 111.21,33.11 arc-45 110.31,32.74 108.12,32.74 arc-45 107.22,33.11 104.51,35.82 arc45 103.61,36.2 87.84,36.2 arc45 86.94,35.82 86.1,34.98 arc45 85.72,34.08 85.72,33.34 85.72,33.02 IC3.6
D4_FLASHMOSI
  Top 0.152: IC2.13 110.78,33.39 arc-45 109.89,33.02 108.48,33.02 arc-45 107.58,33.39 104.83,36.14 arc45 103.93,36.51 87.52,36.51 arc45 86.62,36.14 85.46,34.98 arc45 85.09,34.08 85.09,31.3 arc90 85.6,30.8 86.49,30.8 arc90 87,31.3 IC3.5
D5
  Top 0.152: IC2.24 arc-45 114.19,29.53 102.44,29.53 arc45 101.55,29.16 J3.P$10
D6
  Top 0.152: J3.P$9 100.33,4.65 arc45 100.7,3.76 102.18,2.28 arc45 103.08,1.91 115.55,1.91 arc45 116.44,2.28 117.74,3.57 arc45 118.11,4.47 118.11,17.89 arc-45 118.48,18.79 123.14,23.44 arc45 123.51,24.34 123.51,25.51 arc45 123.14,26.41 118.93,30.61 arc45 118.03,30.98 arc-45 117.66,31.14 IC2.29
D9  (via drill 0.35)
  Top 0.152: IC2.12 109.86,36.12 v109.86,36.2
  Bottom 0.152: v109.86,36.2 103.24,29.58 arc45 102.87,28.68 J3.P$8
D10
  Top 0.152: IC2.27 116.97,30.42 arc45 117.58,30.16 arc-45 118.48,29.79 122.57,25.7 arc-45 122.87,24.97 arc-45 122.5,24.08 116.58,18.15 arc-45 115.68,17.78 SW1.2
D11
  Top 0.152: IC2.25 arc45 116.95,29.53 117.58,29.53 arc-45 118.48,29.16 121.82,25.82 arc-90 121.82,24.03 118.48,20.69 arc-45 117.58,20.32 111.33,20.32 arc45 110.44,19.95 109.59,19.1 arc45 109.22,18.21 109.22,6.24 arc45 109.59,5.34 111.66,3.28 SW1.B1
D12
  Top 0.152: IC2.28 117.26,30.84 arc45 117.75,30.63 arc-45 118.65,30.26 122.82,26.09 arc-45 123.19,25.19 123.19,24.66 arc-45 122.82,23.76 118.16,19.1 arc45 117.79,18.21 117.79,4.62 arc-45 117.42,3.72 116.26,2.56 arc-45 115.36,2.18 108.3,2.18 arc-45 107.4,2.56 SW1.A1
D+
  Top 0.152: IC2.34 119.89,32.44 arc45 120.79,32.07 134.41,32.07 arc45 135.31,32.44 138.06,35.19 arc-45 138.96,35.56 J2.3
D-
  Top 0.152: IC2.33 119.51,32.12 arc45 120.4,31.75 134.73,31.75 arc45 135.63,32.12 138.06,34.55 arc-45 138.96,34.92 140.62,34.92 J2.2
FLASH_CS
  Top 0.152: R21.P$2 81.16,26.27 arc45 82.06,25.89 IC3.1 83.19,26.99 83.67,27.47 arc-45 84.03,27.62 84.58,27.62 arc-90 85.09,27.11 85.09,24.98 arc45 85.24,24.62 85.58,24.28 arc45 85.94,24.13 87.1,24.13 arc45 87.46,24.28 92.97,29.79 arc-45 93.87,30.16 113.39,30.16 arc45 114.29,30.53 IC2.22
GND  (via drill 0.35)  (2 unrouted)
  Top 0.152: IC3.4 87,26.85
  other vias: 88.9,29.21 124.78,39.37 110.49,6.35 88.9,34.29 107.95,35.56 12.7,34.29
  pour Top: -1.27,54.61 -1.27,-1.27 146.05,-1.27 146.05,54.61
  pour Bottom: -1.27,54.61 -1.27,-1.27 146.05,-1.27 146.05,54.61
MISO  (via drill 0.35)
  Top 0.152: v101.6,32.07 101.92,31.75 arc45 104.98,30.48 113,30.48 arc45 113.9,30.85 IC2.21 | R12.P$1 76.46,7.25 arc-45 76.08,8.15 76.08,9.11 arc45 75.71,10.01 68.63,17.09 arc45 65.44,18.41 34.29,18.41 arc-90 33.02,19.68 33.02,28.37 arc45 32.65,29.26 27.99,33.92 arc45 27.1,34.29 LED4.K
  Bottom 0.152: v101.6,32.07 100.86,32.07 arc-45 100.5,32.22 100.48,32.24 arc45 100.12,32.38 24.02,32.38 arc-45 23.12,32.76 LED4.K
MOSI  (via drill 0.35)
  Top 0.152: IC2.19 113.12,31.49 arc-45 112.22,31.11 106.25,31.11 arc-45 105.36,31.49 v102.23,34.61 | R9.P$1 72.39,21.59 arc-90 71.12,22.86 71.12,28.37 arc45 70.75,29.26 66.09,33.92 arc45 65.2,34.29 LED1.K
  Bottom 0.152: v102.23,34.61 101.34,33.71 arc-45 100.44,33.34 61.17,33.34 arc-45 60.27,33.71 LED1.K
N$1
  Top 0.152: U2.P$1 79.17,16.19 R10.P$2
N$4
  Top 0.305: D7.C F1.2
N$5
  Top 0.305: J1.3 131.34,12.42 D7.A
N$6
  Top 0.152: R13.P$2 54.76,34.66 arc45 55.66,34.29 LED1.A
N$7
  Top 0.152: R14.P$2 41.91,37.36 arc45 42.28,36.46 LED2.A
N$8
  Top 0.152: U1.P$1 79.17,21.27 R9.P$2
N$9
  Top 0.152: D1.CATHODE 88.5,20.76 arc45 R5.P$2 86.62,21.59 arc45 85.72,21.22 U1.P$3 81.81,20.32 arc45 80.91,19.95 80.38,19.42 arc-45 79.48,19.05 R1.P$1
N$11
  Top 0.152: D2.CATHODE 88.5,15.68 arc45 R6.P$2 87.25,15.61 arc-45 86.35,15.24 U2.P$3 80.65,15.24 arc45 79.75,14.87 R2.P$1
N$12
  Top 0.152: R15.P$1 32.12,37.72 arc45 31.75,36.82 LED3.A
N$13
  Top 0.152: U3.P$1 79.17,11.11 R11.P$2
N$14
  Top 0.152: D3.CATHODE 88.5,10.6 arc45 R7.P$2 86.62,11.43 arc45 85.72,11.06 U3.P$3 80.65,10.16 arc45 79.75,9.79 R3.P$1
N$15
  Top 0.152: R16.P$1 31.28,39.42 arc-45 30.39,39.05 24.34,39.05 arc45 23.44,38.68 LED4.A
N$16
  Top 0.152: U4.P$1 79.17,6.03 R12.P$2
N$17
  Top 0.152: D4.CATHODE 88.5,5.52 arc45 R8.P$2 86.62,6.35 arc45 85.72,5.98 U4.P$3 80.65,5.08 arc45 79.75,4.71 R4.P$1
N$18
  Top 0.152: U5.P$1 85.61,40.57 R19.P$2 85.06,43.73 arc-45 84.69,44.63 D5.CATHODE 84.69,45.84 R17.P$2
N$19  (via drill 0.35)
  Top 0.152: R18.P$1 v76.2,48.26
  Top 0.508: PIN_O.1 6.35,38.84 arc-45 6.72,39.74 BAN_O.C
  Bottom 0.152: v76.2,48.26 66.41,38.47 arc-45 65.51,38.1 14.65,38.1 arc45 9.15,35.82 PIN_O.1
N$20  (via drill 0.35)
  Top 0.152: R17.P$1 v83.82,48.26
  Top 0.508: BAN_C.C 6.72,24.5 arc45 6.35,23.6 PIN_C.1
  Bottom 0.152: v83.82,48.26 73.71,38.15 arc-45 72.82,37.78 19.58,37.78 arc45 18.68,37.41 6.72,25.45 arc45 6.35,24.56 PIN_C.1
N$21
  Top 0.152: U6.P$1 77.99,40.57 R20.P$2 77.44,43.73 arc-45 77.06,44.63 D6.CATHODE 77.06,45.84 R18.P$2
N$36
  Top 0.305: D8.C D9.A
N$37
  Top 0.152: R1.P$2 73.12,19.05 arc-45 72.22,19.42 72.01,19.63 arc45 71.11,20 66.04,20 arc-90 64.77,21.27 PIN_S.1
  Bottom 0.508: BAN_S.C 61.38,7.62 arc72 66.5,24.01 66.04,25.4 PIN_S.1
N$38
  Top 0.152: PIN_M.1 52.07,20.64 arc90 53.34,19.37 66.39,19.37 arc-45 69.59,18.04 73.29,14.34 arc45 74.19,13.97 R2.P$2
  Bottom 0.508: BAN_M.C 45.76,10.2 arc39 51.59,22.32 PIN_M.1
N$39
  Top 0.152: PIN_T.1 26.67,19.37 arc90 27.94,18.1 65.12,18.1 arc-45 68.32,16.77 75.19,9.9 arc-45 75.56,9 75.56,6.13 arc45 75.94,5.23 R4.P$2
  Bottom 0.508: BAN_T.C 17.78,11.43 arc35 24.87,21.26 PIN_T.1
N$40
  Top 0.152: PIN_B.1 39.37,20 arc90 40.64,18.73 65.75,18.73 arc-45 68.95,17.41 77.36,9.01 R3.P$2
  Bottom 0.508: BAN_B.C 31.69,10.83 arc37 38.3,21.85 PIN_B.1
N$45
  Top 0.152: C8.P$1 X1.P$1 115.5,39.66 arc-45 115.13,38.76 IC2.1
N$46
  Top 0.152: C9.P$1 X1.P$2 113.1,40.47 arc45 113.47,39.57 IC2.2
SCK  (via drill 0.35)
  Top 0.152: v102.87,32.7 104.78,30.8 112.61,30.8 arc45 113.51,31.17 IC2.20 | LED3.K 39.8,34.29 arc-45 40.69,33.92 45.35,29.26 arc-45 45.72,28.37 45.72,20.32 arc90 46.99,19.05 66.07,19.05 arc-45 69.27,17.73 75.19,11.8 arc45 76.09,11.43 R11.P$1
  Bottom 0.152: v102.87,32.7 36.4,32.7 arc-45 35.51,33.07 LED3.K
SCL
  Top 0.152: IC2.32 123.77,27.15 arc-45 124.14,26.25 124.14,23.7 arc-45 123.77,22.81 119.12,18.15 arc45 118.75,17.25 118.75,4.26 arc-45 118.37,3.36 116.69,1.68 arc-45 115.8,1.31 102.64,1.31 arc-45 101.75,1.68 100.11,3.32 arc-45 99.73,4.22 99.73,15.39 arc45 99.36,16.29 91.49,24.15 arc-45 91.12,25.05 91.12,25.59 arc-45 91.49,26.48 91.63,26.62 arc-45 92.52,26.99 93.14,26.99 arc-45 94.03,26.62 J3.P$11
SDA
  Top 0.152: J3.P$12 99.64,18.47 arc-45 100.01,17.57 100.01,4.47 arc45 100.38,3.57 102,1.96 arc45 102.9,1.59 115.62,1.59 arc45 116.52,1.96 118.06,3.49 arc45 118.43,4.39 118.43,17.57 arc-45 118.8,18.47 123.45,23.12 arc45 123.83,24.02 123.83,25.86 arc45 123.45,26.76 IC2.31
SWCLK
  Top 0.152: IC2.45 118.51,39 arc-45 119.41,39.37 120.76,39.37 arc45 121.66,39.74 125.73,43.81 J4.P$3
SWDIO
  Top 0.152: IC2.46 118.12,39.32 arc-45 119.02,39.69 120.44,39.69 arc45 121.34,40.06 122.18,40.9 arc45 122.56,41.8 122.56,43.29 arc45 122.18,44.19 J4.P$5
VDDCORE1
  Top 0.152: C3.P$1 119.23,37.78 arc45 118.34,37.41 IC2.43

### Text on the board
tPlace: LED / Power | G | G | R | R
tNames: ⏚ | Pulsar Buddy | rev. E | Other | Clock | swdio | gnd | swclk | +3.3v | reset | O | T | B | M | S | Tuplet | Beat | Measure | Sequence | C